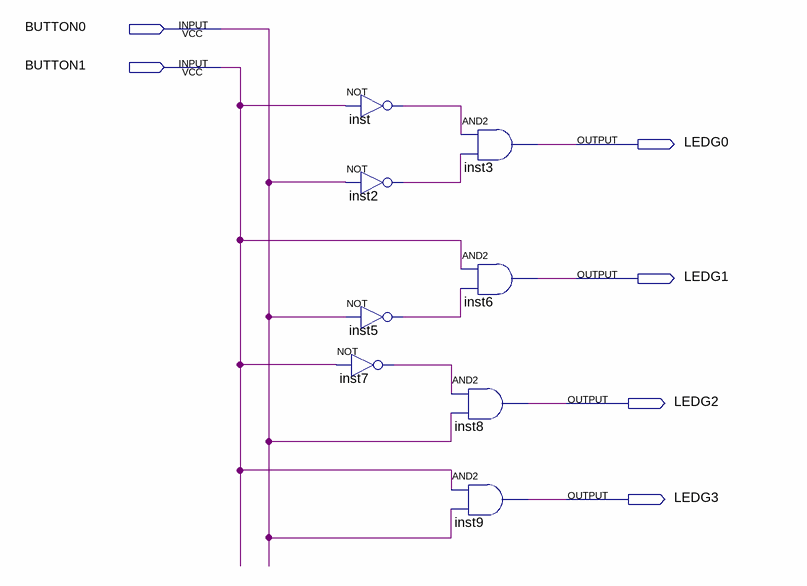
[diagram p0: schematic sheet]
// Quartus schematic lab4_1.bdf as structural Verilog: 8 symbols, 6 pins
module lab4_1 (
  input  BUTTON0,
  input  BUTTON1,
  output LEDG0,
  output LEDG1,
  output LEDG2,
  output LEDG3
);

  wire inst2_out, inst5_out, inst7_out, inst_out;

  not inst (inst_out, BUTTON1);
  not inst2 (inst2_out, BUTTON0);
  not inst5 (inst5_out, BUTTON0);
  not inst7 (inst7_out, BUTTON1);
  and inst3 (LEDG0, inst_out, inst2_out);
  and inst6 (LEDG1, BUTTON1, inst5_out);
  and inst8 (LEDG2, inst7_out, BUTTON0);
  and inst9 (LEDG3, BUTTON1, BUTTON0);
endmodule
